# Altium schematic sheet H_bridge.SchDoc: H bridge
size A4; Organization: Zigman NIkita; Address3: zigman.nikita@gmail.com; DocumentNumber: 1.0; Revision: ZN; SheetNumber: 3; SheetTotal: 6
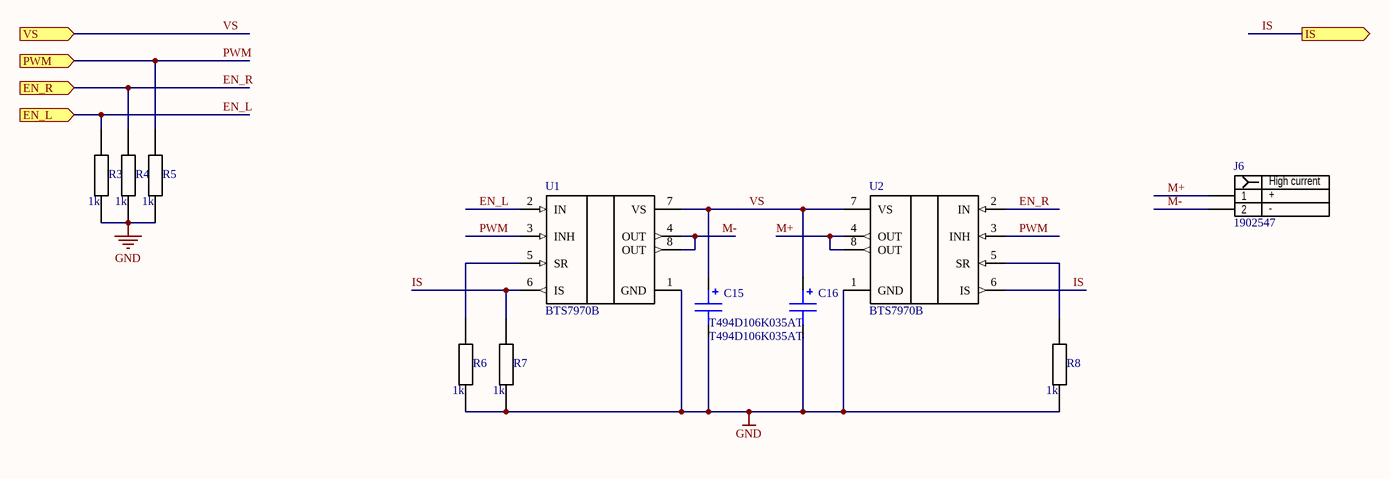
[diagram p0: H_bridge.SchDoc]

## Parts
C15  T494D106K035AT  [CAPPM7343X310N]
C16  T494D106K035AT  [CAPPM7343X310N]
J6  1902547  [1902547]
R3  1k  [RESC1608X55N]
R4  1k  [RESC1608X55N]
R5  1k  [RESC1608X55N]
R6  1k  [RESC1608X55N]
R7  1k  [RESC1608X55N]
R8  1k  [RESC1608X55N]
U1  BTS7970B  [PG-TO263-7-1]
U2  BTS7970B  [PG-TO263-7-1]

## Ports
EN_L (in), EN_R (in), IS (out), PWM (in), VS (in)

## Nets
GND: C15.2(-) C16.2(-) R3.1 R4.1 R5.1 R6.1 R7.1 R8.1 U1.1(GND) U2.1(GND)
EN_L: R3.2 U1.2(IN) ; port EN_L
EN_R: R4.2 U2.2(IN) ; port EN_R
IS: R7.2 U1.6(IS) U2.6(IS) ; port IS
M+: J6.1 U2.4(OUT) U2.8(OUT)
M-: J6.2 U1.4(OUT) U1.8(OUT)
PWM: R5.2 U1.3(INH) U2.3(INH) ; port PWM
VS: C15.1(+) C16.1(+) U1.7(VS) U2.7(VS) ; port VS
NetR6_2: R6.2 U1.5(SR)
NetR8_2: R8.2 U2.5(SR)

## Notes on the sheet
- Title
- Size:
- Date:
- A4
- Number:
- Time:
- Revision:
- Sheet
- of
- File:
- (in symbol 1902547) High current; +; -

## Library data of the parts
C15 C16 = T494D106K035AT: Capacitor Polarised; Manufacturer_Name: Kemet; Datasheet Link: http://www.mouser.com/ds/2/212/kemet_kem_t2008_t494-544880.pdf; Height: 3.1mm; Manufacturer_Part_Number: T494D106K035AT; Arrow Part Number: T494D106K035AT; Arrow Price/Stock: https://www.arrow.com/en/products/t494d106k035at/kemet-corporation; Mouser Part Number: 80-T494D106K035; Mouser Price/Stock: https://www.mouser.com/Search/Refine.aspx?Keyword=80-T494D106K035
J6 = 1902547: Phoenix Contact MKDS 5 HV/2-9.52; Datasheet Link: https://www.arrow.com/en/products/1902547/phoenix-contact; Height: 21.7mm; Manufacturer_Name: Phoenix Contact; Manufacturer_Part_Number: 1902547; Arrow Part Number: 1902547; Arrow Price/Stock: https://www.arrow.com/en/products/1902547/phoenix-contact; Mouser Part Number: 651-1902547; Mouser Price/Stock: https://www.mouser.co.uk/ProductDetail/Phoenix-Contact/1902547?qs=wd%252Bw3mUqFrmbAnEXicRpKg%3D%3D
R3-R8 = res 0603: RS PRO SMD-Widerstand, 1kΩ ±5%; Manufacturer_Name: RS PRO; Datasheet Link: https://at.rs-online.com/web/p/smd-widerstande/7134141/; Height: 0.55mm
U1 U2 = BTS7970B: Infineon Motor Driver IC BTN7970BAUMA1, 50A, 25kHz, TO-263, 7-Pin, BLDC; MF: Infineon; SnapEDA_Link: https://at.rs-online.com/web/p/motor-treiber-ics/7264068/; MP: BTS7970B; Price: None; Package: PG-TO263-7-1; Value: *; Availability: Unavailable